# EAGLE schematic STM32VGT ATAS v10 (EAGLE 9.7.0)
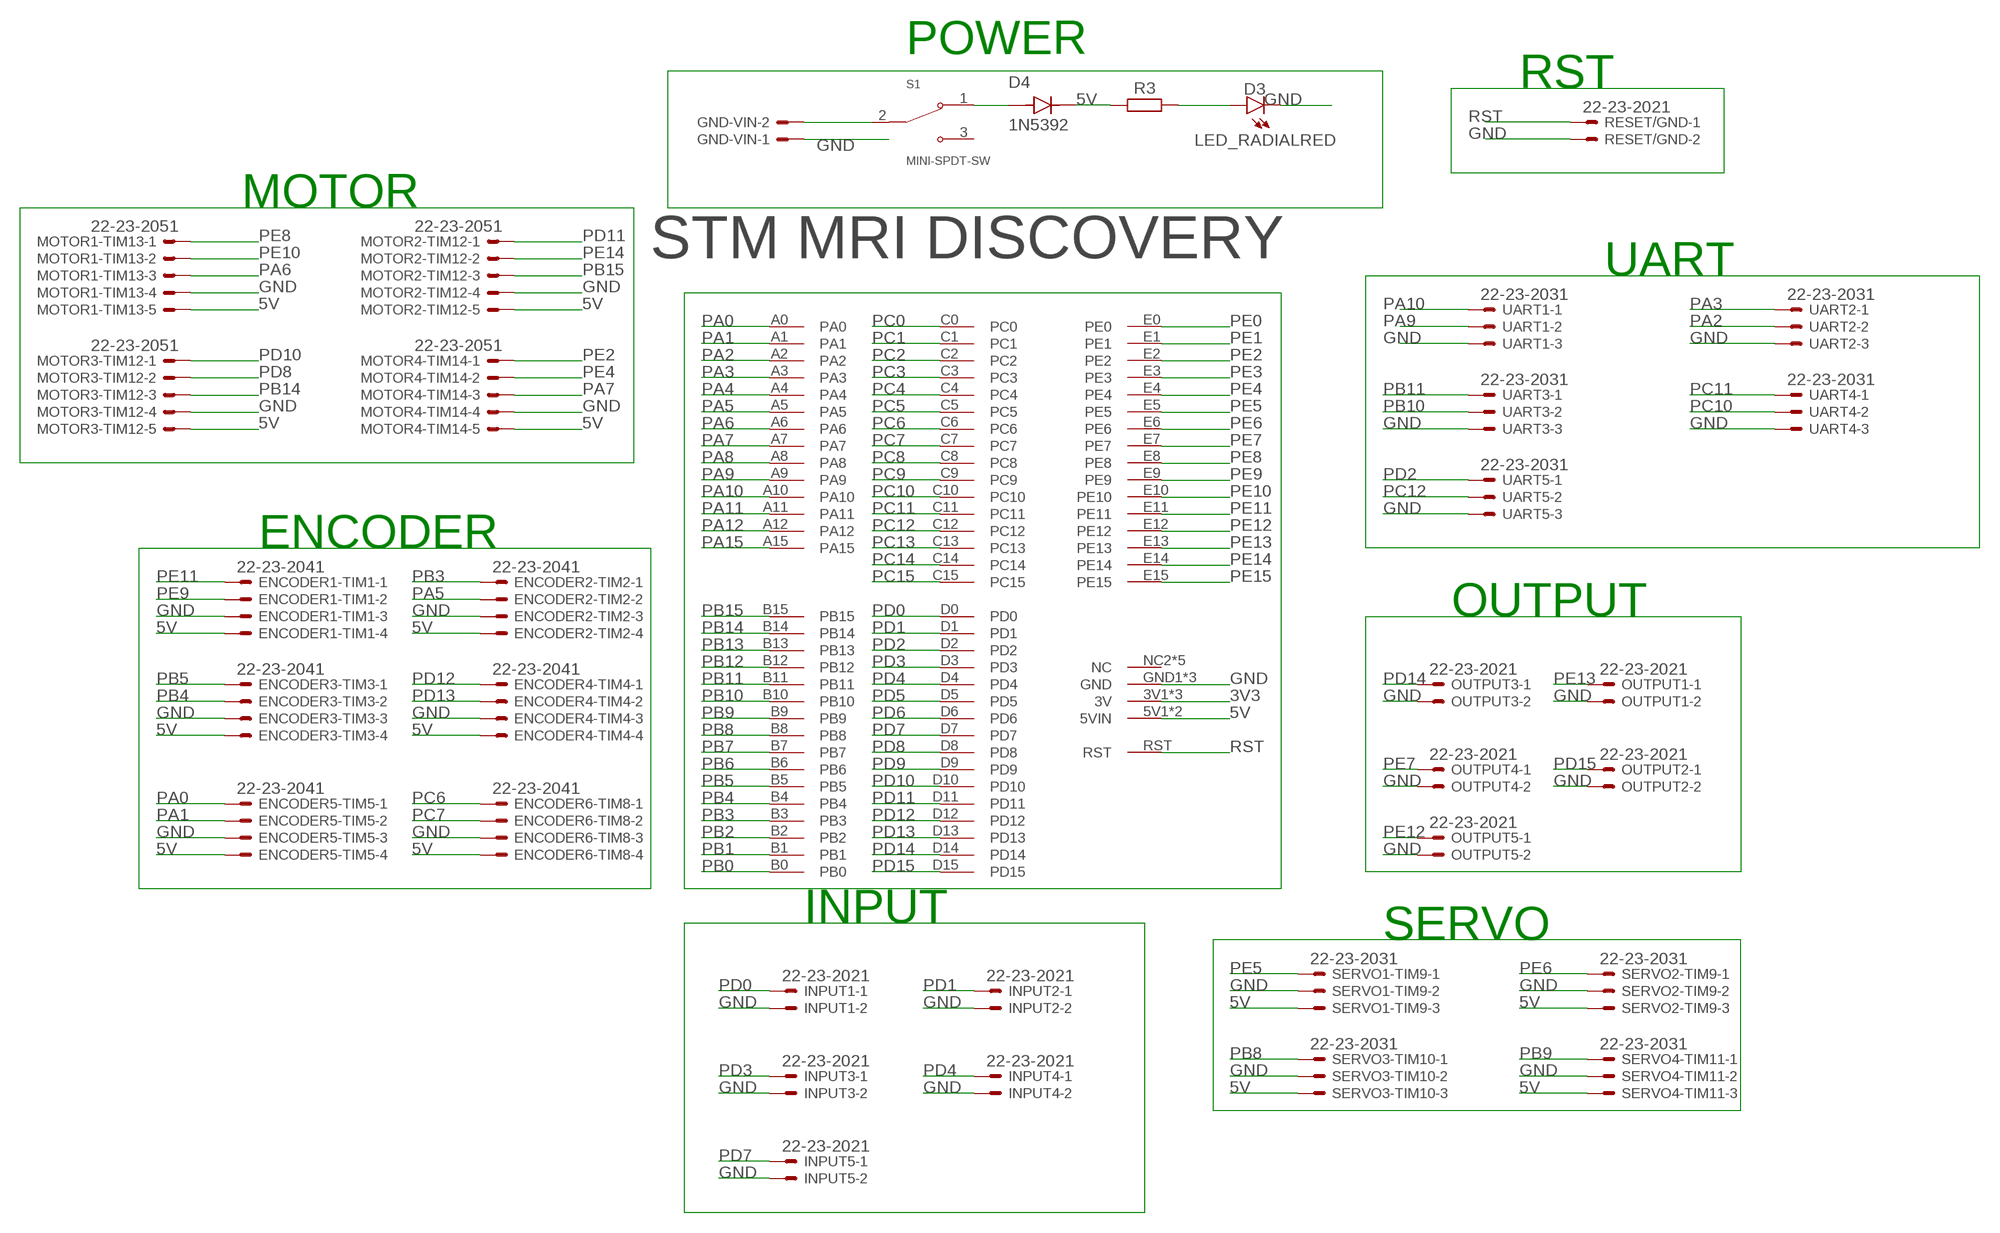
[diagram p0: schematic, sheet 1]

## Parts
D3  LED_RADIALRED  [LEDRD254W60D565H860B_R]
D4  1N5392  [DIOAD1300W80L670D310]
ENCODER1-TIM1  22-23-2041  [22-23-2041]
ENCODER2-TIM2  22-23-2041  [22-23-2041]
ENCODER3-TIM3  22-23-2041  [22-23-2041]
ENCODER4-TIM4  22-23-2041  [22-23-2041]
ENCODER5-TIM5  22-23-2041  [22-23-2041]
ENCODER6-TIM8  22-23-2041  [22-23-2041]
GND-VIN  22-23-2021  [22-23-2021]
INPUT1  22-23-2021  [22-23-2021]
INPUT2  22-23-2021  [22-23-2021]
INPUT3  22-23-2021  [22-23-2021]
INPUT4  22-23-2021  [22-23-2021]
INPUT5  22-23-2021  [22-23-2021]
MOTOR1-TIM13  22-23-2051  [22-23-2051]
MOTOR2-TIM12  22-23-2051  [22-23-2051]
MOTOR3-TIM12  22-23-2051  [22-23-2051]
MOTOR4-TIM14  22-23-2051  [22-23-2051]
OUTPUT1  22-23-2021  [22-23-2021]
OUTPUT2  22-23-2021  [22-23-2021]
OUTPUT3  22-23-2021  [22-23-2021]
OUTPUT4  22-23-2021  [22-23-2021]
OUTPUT5  22-23-2021  [22-23-2021]
R3  R_AXIAL-11.7MM-PITCH  [RESAD1176W63L850D250B]
RESET/GND  22-23-2021  [22-23-2021]
S1  MINI-SPDT-SW  [SW_MINI-SPDT-SW]
SERVO1-TIM9  22-23-2031  [22-23-2031]
SERVO2-TIM9  22-23-2031  [22-23-2031]
SERVO3-TIM10  22-23-2031  [22-23-2031]
SERVO4-TIM11  22-23-2031  [22-23-2031]
U$1  STM32F4HEADER  [STM32F4HEAD]
UART1  22-23-2031  [22-23-2031]
UART2  22-23-2031  [22-23-2031]
UART3  22-23-2031  [22-23-2031]
UART4  22-23-2031  [22-23-2031]
UART5  22-23-2031  [22-23-2031]

## Nets
3V3: U$1.3V1(3V) U$1.3V2(3V) U$1.3V3(3V)
5V: D4.C(K) ENCODER1-TIM1.4 ENCODER2-TIM2.4 ENCODER3-TIM3.4 ENCODER4-TIM4.4 ENCODER5-TIM5.4 ENCODER6-TIM8.4 MOTOR1-TIM13.5 MOTOR2-TIM12.5 MOTOR3-TIM12.5 MOTOR4-TIM14.5 R3.1 SERVO1-TIM9.3 SERVO2-TIM9.3 SERVO3-TIM10.3 SERVO4-TIM11.3 U$1.5V1(5VIN) U$1.5V2(5VIN)
GND: D3.C ENCODER1-TIM1.3 ENCODER2-TIM2.3 ENCODER3-TIM3.3 ENCODER4-TIM4.3 ENCODER5-TIM5.3 ENCODER6-TIM8.3 GND-VIN.1 INPUT1.2 INPUT2.2 INPUT3.2 INPUT4.2 INPUT5.2 MOTOR1-TIM13.4 MOTOR2-TIM12.4 MOTOR3-TIM12.4 MOTOR4-TIM14.4 OUTPUT1.2 OUTPUT2.2 OUTPUT3.2 OUTPUT4.2 OUTPUT5.2 RESET/GND.2 SERVO1-TIM9.2 SERVO2-TIM9.2 SERVO3-TIM10.2 SERVO4-TIM11.2 U$1.GND1(GND) U$1.GND2(GND) U$1.GND3(GND) UART1.3 UART2.3 UART3.3 UART4.3 UART5.3
N$4: D4.A S1.1
N$5: GND-VIN.2 S1.2
N$8: D3.A R3.2
PA0: ENCODER5-TIM5.1 U$1.A0
PA1: ENCODER5-TIM5.2 U$1.A1
PA2: U$1.A2 UART2.2
PA3: U$1.A3 UART2.1
PA4: U$1.A4
PA5: ENCODER2-TIM2.2 U$1.A5
PA6: MOTOR1-TIM13.3 U$1.A6
PA7: MOTOR4-TIM14.3 U$1.A7
PA8: U$1.A8
PA9: U$1.A9 UART1.2
PA10: U$1.A10 UART1.1
PA11: U$1.A11
PA12: U$1.A12
PA15: U$1.A15
PB0: U$1.B0
PB1: U$1.B1
PB2: U$1.B2
PB3: ENCODER2-TIM2.1 U$1.B3
PB4: ENCODER3-TIM3.2 U$1.B4
PB5: ENCODER3-TIM3.1 U$1.B5
PB6: U$1.B6
PB7: U$1.B7
PB8: SERVO3-TIM10.1 U$1.B8
PB9: SERVO4-TIM11.1 U$1.B9
PB10: U$1.B10 UART3.2
PB11: U$1.B11 UART3.1
PB12: U$1.B12
PB13: U$1.B13
PB14: MOTOR3-TIM12.3 U$1.B14
PB15: MOTOR2-TIM12.3 U$1.B15
PC0: U$1.C0
PC1: U$1.C1
PC2: U$1.C2
PC3: U$1.C3
PC4: U$1.C4
PC5: U$1.C5
PC6: ENCODER6-TIM8.1 U$1.C6
PC7: ENCODER6-TIM8.2 U$1.C7
PC8: U$1.C8
PC9: U$1.C9
PC10: U$1.C10 UART4.2
PC11: U$1.C11 UART4.1
PC12: U$1.C12 UART5.2
PC13: U$1.C13
PC14: U$1.C14
PC15: U$1.C15
PD0: INPUT1.1 U$1.D0
PD1: INPUT2.1 U$1.D1
PD2: U$1.D2 UART5.1
PD3: INPUT3.1 U$1.D3
PD4: INPUT4.1 U$1.D4
PD5: U$1.D5
PD6: U$1.D6
PD7: INPUT5.1 U$1.D7
PD8: MOTOR3-TIM12.2 U$1.D8
PD9: U$1.D9
PD10: MOTOR3-TIM12.1 U$1.D10
PD11: MOTOR2-TIM12.1 U$1.D11
PD12: ENCODER4-TIM4.1 U$1.D12
PD13: ENCODER4-TIM4.2 U$1.D13
PD14: OUTPUT3.1 U$1.D14
PD15: OUTPUT2.1 U$1.D15
PE0: U$1.E0
PE1: U$1.E1
PE2: MOTOR4-TIM14.1 U$1.E2
PE3: U$1.E3
PE4: MOTOR4-TIM14.2 U$1.E4
PE5: SERVO1-TIM9.1 U$1.E5
PE6: SERVO2-TIM9.1 U$1.E6
PE7: OUTPUT4.1 U$1.E7
PE8: MOTOR1-TIM13.1 U$1.E8
PE9: ENCODER1-TIM1.2 U$1.E9
PE10: MOTOR1-TIM13.2 U$1.E10
PE11: ENCODER1-TIM1.1 U$1.E11
PE12: OUTPUT5.1 U$1.E12
PE13: OUTPUT1.1 U$1.E13
PE14: MOTOR2-TIM12.2 U$1.E14
PE15: U$1.E15
RST: RESET/GND.1 U$1.RST
Unconnected: S1.3 U$1.NC2(NC) U$1.NC3(NC) U$1.NC4(NC) U$1.NC5(NC) U$1.NC6(NC)

## Notes on the sheet
- POWER
- RST
- MOTOR
- UART
- ENCODER
- OUTPUT
- INPUT
- SERVO

## Library data of the parts
D3 = Opto-Electronic:LED_RADIAL: LED - Generic
D4 = 1N5392:1N5392: Check availability <https://pricing.snapeda.com/parts/1N5392/onsemi/view-part?ref=eda>; AVAILABILITY: In Stock; CHECK_PRICES: https://www.snapeda.com/parts/1N5392/Onsemi/view-part/?ref=eda; DESCRIPTION: Diode 100 V 1.5A Through Hole DO-15; MF: onsemi; MP: 1N5392; PACKAGE: None; PRICE: None; SNAPEDA_LINK: https://www.snapeda.com/parts/1N5392/Onsemi/view-part/?ref=snap
ENCODER1-TIM1 ENCODER2-TIM2 ENCODER3-TIM3 ENCODER4-TIM4 ENCODER5-TIM5 ENCODER6-TIM8 = con-molex:22-23-2041: .100" (2.54mm) Center Header - 4 Pin; MF: MOLEX; MPN: 22-23-2041; OC_FARNELL: 1462920; OC_NEWARK: 38C0355
GND-VIN INPUT1-INPUT5 OUTPUT1-OUTPUT5 RESET/GND = con-molex:22-23-2021: .100" (2.54mm) Center Header - 2 Pin; MF: MOLEX; MPN: 22-23-2021; OC_FARNELL: 1462926; OC_NEWARK: 25C3832
MOTOR1-TIM13 MOTOR2-TIM12 MOTOR3-TIM12 MOTOR4-TIM14 = con-molex:22-23-2051: .100" (2.54mm) Center Header - 5 Pin; MF: MOLEX; MPN: 22-23-2051; OC_FARNELL: 1462952; OC_NEWARK: 38C9178
R3 = Resistor:R: Resistor Fixed - Generic; CATEGORY: Resistor; SUB-CATEGORY: Fixed
S1 = MINI-SPDT-SW:MINI-SPDT-SW: Simple breadboard friendly SPDT slide switch. Rated at 30V/200mA with operating force of 250 +/-100gf. Check availability <https://pricing.snapeda.com/parts/MINI-SPDT-SW/Gravitech/view-part?ref=eda>; AVAILABILITY: Not in stock; CHECK_PRICES: https://www.snapeda.com/parts/MINI-SPDT-SW/Gravitech/view-part/?ref=eda; DESCRIPTION: Slide Switches MINI SPDT SWITCH; MF: Gravitech; MP: MINI-SPDT-SW; PACKAGE: None; PRICE: None; SNAPEDA_LINK: https://www.snapeda.com/parts/MINI-SPDT-SW/Gravitech/view-part/?ref=snap
SERVO1-TIM9 SERVO2-TIM9 SERVO3-TIM10 SERVO4-TIM11 UART1-UART5 = con-molex:22-23-2031: .100" (2.54mm) Center Header - 3 Pin; MF: MOLEX; MPN: 22-23-2031; OC_FARNELL: 1462950; OC_NEWARK: 30C0862
U$1 = stm32header:STM32F4HEADER